# Altium schematic sheet SAMD51.SchDoc
size A4
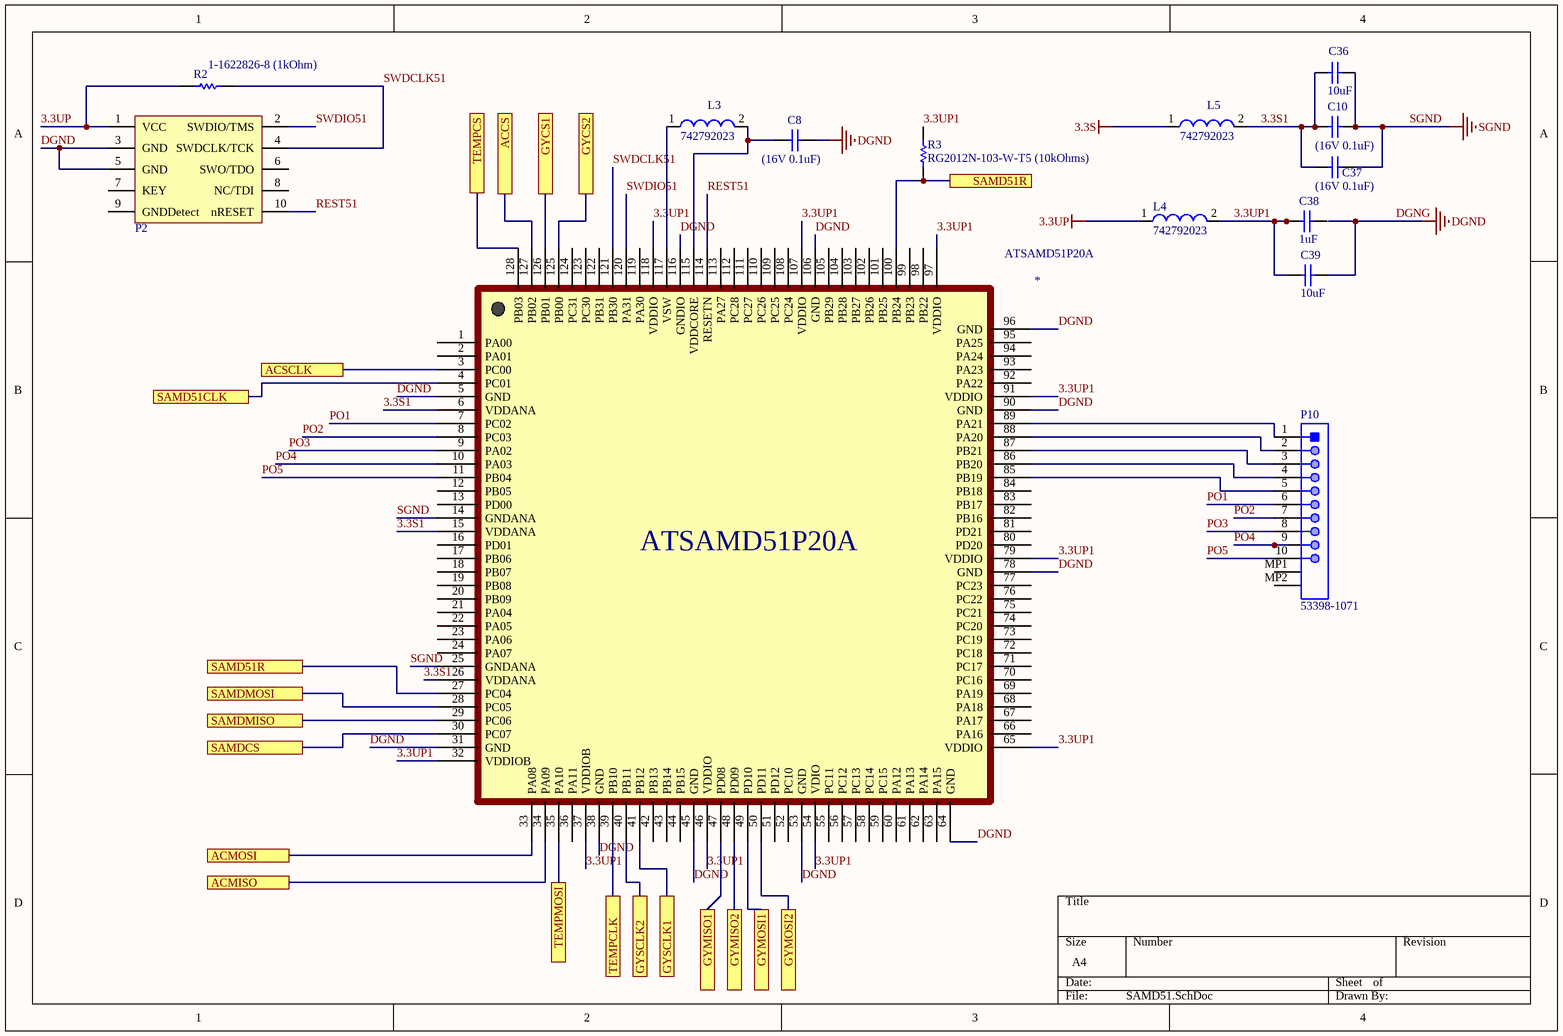
[diagram p0: SAMD51.SchDoc]

## Parts
*  ATSAMD51P20A  [ATSAMD51P20A]
C8  (16V 0.1uF)  [CAPC1608X90X35LL15T15]
C10  (16V 0.1uF)  [CAPC1608X90X35LL15T15]
C36  10uF  [CAPC1608X90X35NL10T15]
C37  (16V 0.1uF)  [CAPC1608X90X35LL15T15]
C38  1uF  [CAPC1608X90X35LL15T15]
C39  10uF  [CAPC1608X90X35NL10T15]
L3  742792023  [SMD-0805]
L4  742792023  [SMD-0805]
L5  742792023  [SMD-0805]
P2  3220-10-0100-00 Pin connector for Cotex Programmers  (value not drawn)
P10  53398-1071  [MOLX-53398-1071_V]
R2  1-1622826-8 (1kOhm)  [RESC1005X40X25ML10T10]
R3  RG2012N-103-W-T5 (10kOhms)  [RESC2013X50X40NL20T20]

## Ports
ACCS, ACMISO, ACMOSI, ACSCLK, GYCS1, GYCS2, GYMISO1, GYMISO2, GYMOSI1, GYMOSI2, GYSCLK1, GYSCLK2, SAMD51CLK, SAMD51R, SAMDCS, SAMDMISO, SAMDMOSI, TEMPCLK, TEMPCS, TEMPMOSI

## Nets
3.3S: L5.1
3.3UP: L4.1 P2.1(VCC) R2.2
DGND: *.5(GND) *.31(GND) *.38(GND) *.45(GND) *.53(GND) *.64(GND) *.78(GND) *.90(GND) *.96(GND) *.106(GND) *.116(GNDIO) C8.2 C39.1 P2.3(GND) P2.5(GND)  [also labelled DGNG]
SGND: *.14(GNDANA) *.25(GNDANA) C10.2 C36.1 C37.2
3.3S1: *.6(VDDANA) *.15(VDDANA) *.26(VDDANA) C10.1 C36.2 C37.1 L5.2
3.3UP1: *.32(VDDIOB) *.37(VDDIOB) *.46(VDDIO) *.54(VDIO) *.65(VDDIO) *.79(VDDIO) *.91(VDDIO) *.97(VDDIO) *.107(VDDIO) *.118(VDDIO) C38.2 C39.2 L4.2 R3.2
ACCS: *.127(PB02) ; port ACCS
ACMISO: *.34(PA09) ; port ACMISO
ACMOSI: *.33(PA08) ; port ACMOSI
ACSCLK: *.3(PC00) ; port ACSCLK
GYCS1: *.126(PB01) ; port GYCS1
GYCS2: *.125(PB00) ; port GYCS2
GYMISO1: *.47(PD08) ; port GYMISO1
GYMISO2: *.48(PD09) ; port GYMISO2
GYMOSI1: *.49(PD10) ; port GYMOSI1
GYMOSI2: *.50(PD11) ; port GYMOSI2
GYSCLK1: *.41(PB12) ; port GYSCLK1
GYSCLK2: *.40(PB11) ; port GYSCLK2
PO1: *.7(PC02) P10.6
PO2: *.8(PC03) P10.7
PO3: *.9(PA02) P10.8
PO4: *.10(PA03) P10.9
PO5: *.11(PB04) P10.10
REST51: *.114(RESETN) P2.10(nRESET)
SAMD51CLK: *.4(PC01) ; port SAMD51CLK
SAMD51R: *.27(PC04) *.100(PB24) R3.1 ; port SAMD51R
SAMDCS: *.30(PC07) ; port SAMDCS
SAMDMISO: *.29(PC06) ; port SAMDMISO
SAMDMOSI: *.28(PC05) ; port SAMDMOSI
SWDCLK51: *.121(PB30) P2.4(SWDCLK/TCK) R2.1
SWDIO51: *.120(PA31) P2.2(SWDIO/TMS)
TEMPCLK: *.39(PB10) ; port TEMPCLK
TEMPCS: *.128(PB03) ; port TEMPCS
TEMPMOSI: *.35(PA10) ; port TEMPMOSI
Net*_85: *.85(PB19) P10.5
Net*_86: *.86(PB20) P10.4
Net*_87: *.87(PB21) P10.3
Net*_88: *.88(PA20) P10.2
Net*_89: *.89(PA21) P10.1
Net*_115: *.115(VDDCORE) C8.1 L3.2
Net*_117: *.117(VSW) L3.1

Not connected (* = marked no-connect by the designer): * 1(PA00) 2(PA01) 12(PB05) 13(PD00) 16(PD01) 17(PB06) 18(PB07) 19(PB08) 20(PB09) 21(PA04) 22(PA05) 23(PA06) 24(PA07) 36(PA11) 42(PB13) 43(PB14) 44(PB15) 51(PD12) 52(PC10) 55(PC11) 56(PC12) 57(PC13) 58(PC14) 59(PC15) 60(PA12) 61(PA13) 62(PA14) 63(PA15) 66(PA16) 67(PA17) 68(PA18) 69(PA19) 70(PC16) 71(PC17) 72(PC18) 73(PC19) 74(PC20) 75(PC21) 76(PC22) 77(PC23) 80(PD20) 81(PD21) 82(PB16) 83(PB17) 84(PB18) 92(PA22) 93(PA23) 94(PA24) 95(PA25) 98(PB22) 99(PB23) 101(PB25) 102(PB26) 103(PB27) 104(PB28) 105(PB29) 108(PC24) 109(PC25) 110(PC26) 111(PC27) 112(PC28) 113(PA27) 119(PA30) 122(PB31) 123(PC30) 124(PC31); C38 1; P2 6(SWO/TDO) 7(KEY) 8(NC/TDI) 9(GNDDetect); P10 MP1 MP2

## Library data of the parts
* = ATSAMD51P20A: https://www.microchip.com/wwwproducts/en/ATSAMD51P20A#additional-features; ComponentLink1Description: ATSAMD51P20A; ComponentLink1URL: https://www.microchip.com/wwwproducts/en/ATSAMD51P20A#additional-features
C8 C10 C37 = CMP-2006-02126-1: Part Number: 0603YC104MAT4A; Manufacturer: AVX Interconnect / Elco
C36 C39 = CMP-2006-02792-1: Part Number: GRM188R60J106ME47D; Manufacturer: Murata
C38 = CMP-2006-04551-1: Part Number: 0603ZC105KAT2A; Manufacturer: AVX Interconnect / Elco
L3-L5 = CMP-0220-00030-1: SMD EMI Suppression Ferrite Bead WE-CBF, Z = 120 Ohm; Impedance: 120 Ohm; PackageDescription: Chip Inductor, 2-Leads, Body 2.0 x 1.2 mm; ComponentLink2URL: http://www.we-online.de/katalog/media/pdf/742792023.pdf; ComponentLink1Description: Manufacturer Link; ComponentLink2Description: Datasheet; DatasheetVersion: Dec-2005; PackageReference: SMD-0805; ComponentLink1URL: http://www.we-online.com; PackageVersion: 2005
P2 = 3220-10-0100-00: 3220-10-0100-00 Pin connector from DigiKey; ComponentLink1Description: 3220-10-0100-00; ComponentLink1URL: https://www.digikey.com/product-detail/en/cnc-tech/3220-10-0100-00/1175-1627-ND/3883661
P10 = CMP-2000-05635-1: Male Header, Pitch 1.25 mm, 1 x 10 Position, Height 4.7 mm, -40 to 85 degC, RoHS, Tape and Reel; Manufacturer: Molex; Mounting Angle: Vertical; Pitch: 1.25mm; Voltage Rating: 125V; Current Rating: 1A; Number of Rows: 1Row; Housing Material: Nylon; Mounting Technology: SurfaceMount; Mounting Style: SMD; Contact Material: PhosphorBronze; Product: Headers; Datasheet URL: http://www.molex.com/pdm_docs/sd/533981071_sd.pdf; Manufacturer URL: http://www.molex.com/; Datasheet Version: Rev. J, 09/2015; Factory Pack Quantity: 1000; Brand: Molex; Packaging: Reel; Product Category: Headers&WireHousings; Contact Gender: Pin(Male); Number of Positions: 10Position; RoHS: Details; Contact Plating: Tin; Package Description: Male Header, Pitch 1.25 mm, 1 x 10 Position, Height 4.7 mm; Series: 53398; Type: Shrouded; Package Reference: 53398-1071; Tradename: PicoBlade; Termination Style: SMD
R2 = CMP-2002-04643-1: Manufacturer: TE Connectivity / AMP; Part Number: 1-1622826-8
R3 = CMP-2001-04803-1: Manufacturer: Susumu; Part Number: RG2012N-103-W-T5